# Altium schematic sheet FLATSAT001.SchDoc: Title Block Template
size A3; Engineer: M. BRINDLEY; Organization: BLUEsat Project; Address1: Room 419; Address2: School of EE&T; Address3: UNSW, NSW 2052; Address4: Australia; DocumentNumber: TITL0001; Description: Sample Title Block; Version: 1.0
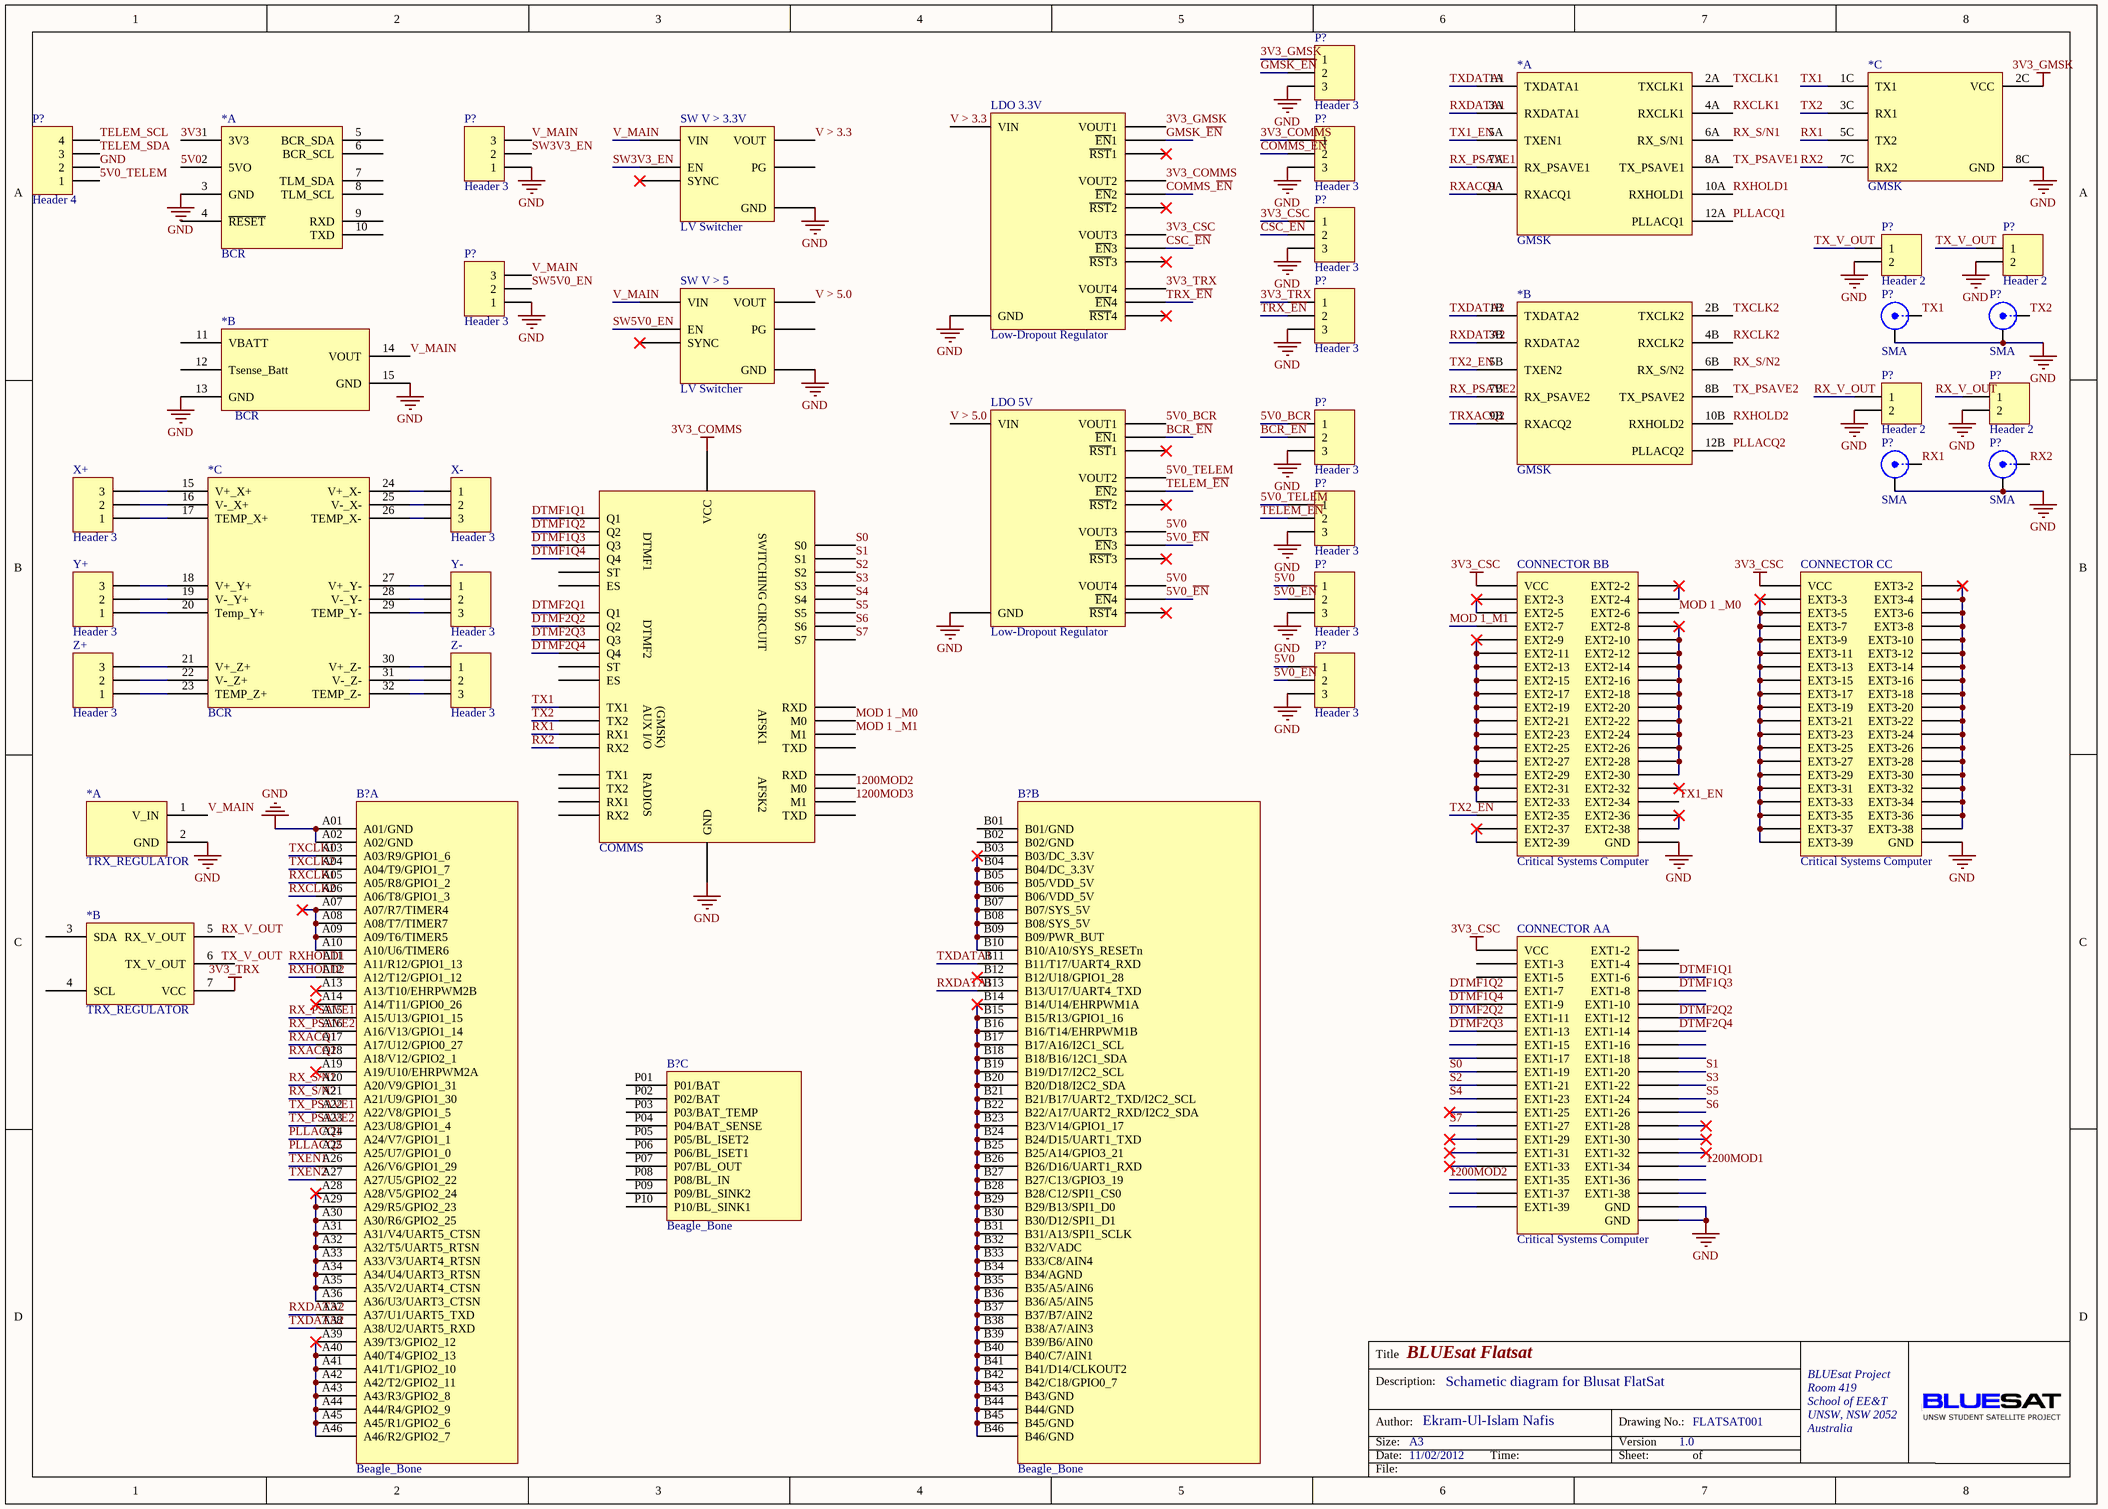
[diagram p0: FLATSAT001.SchDoc]

## Parts
(Parts that share a designator on the sheet are numbered #1, #2 ... from top to bottom, then left to right.)
*#1  GMSK  [GMSK]  (part C of 3)
*#2  GMSK  [GMSK]  (part A of 3)
*#3  BCR  (part A of 3)
*#4  BCR  (part B of 3)
*#5  GMSK  [GMSK]  (part B of 3)
*#6  BCR  (part C of 3)
*#7  TRX_REGULATOR  [TRX_REGULATOR]  (part A of 2)
*#8  TRX_REGULATOR  [TRX_REGULATOR]  (part B of 2)
B*  COMMS  [Communications]
B?#1  Beagle_Bone  [Beaglebone]  (part B of 3)
B?#2  Beagle_Bone  [Beaglebone]  (part A of 3)
B?#3  Beagle_Bone  [Beaglebone]  (part C of 3)
CONNECTOR_A  Critical Systems Computer  [CSC]  (part A of 3)
CONNECTOR_B  Critical Systems Computer  [CSC]  (part B of 3)
CONNECTOR_C  Critical Systems Computer  [CSC]  (part C of 3)
LDO_3.3V  Low-Dropout Regulator  [LDO]
LDO_5V  Low-Dropout Regulator  [LDO]
P?#1  Header 3  [HDR1X3]
P?#2  Header 3  [HDR1X3]
P?#3  Header 3  [HDR1X3]
P?#4  Header 4  [HDR1X4]
P?#5  Header 3  [HDR1X3]
P?#6  Header 2  [HDR1X2]
P?#7  Header 2  [HDR1X2]
P?#8  Header 3  [HDR1X3]
P?#9  SMA  [SMB_V-RJ45]
P?#10  SMA  [SMB_V-RJ45]
P?#11  Header 3  [HDR1X3]
P?#12  Header 2  [HDR1X2]
P?#13  Header 2  [HDR1X2]
P?#14  Header 3  [HDR1X3]
P?#15  SMA  [SMB_V-RJ45]
P?#16  SMA  [SMB_V-RJ45]
P?#17  Header 3  [HDR1X3]
P?#18  Header 3  [HDR1X3]
P?#19  Header 3  [HDR1X3]
SW_V_>_3.3V  LV Switcher  [LVSwitcher]
SW_V_>_5  LV Switcher  [LVSwitcher]
X+  Header 3  [HDR1X3]
X-  Header 3  [HDR1X3]
Y+  Header 3  [HDR1X3]
Y-  Header 3  [HDR1X3]
Z+  Header 3  [HDR1X3]
Z-  Header 3  [HDR1X3]

## Nets
3V3_COMMS: B*.?1(VCC) LDO_3.3V.VOUT2 P?#2.1
3V3_CSC: CONNECTOR_A.C1_1(VCC) CONNECTOR_B.C2_1(VCC) CONNECTOR_C.C3_1(VCC) LDO_3.3V.VOUT3 P?#5.1
3V3_GMSK: *#1.2C(VCC) LDO_3.3V.VOUT1 P?#1.1
3V3_TRX: *#8.7(VCC) LDO_3.3V.VOUT4 P?#8.1
GND: *#1.8C(GND) *#3.3(GND) *#4.13(GND) *#4.15(GND) *#7.2(GND) B*.GND B?#2.A01(A01/GND) B?#2.A02(A02/GND) CONNECTOR_A.C1_40(GND) CONNECTOR_A.GND CONNECTOR_B.C2_40(GND) CONNECTOR_C.C3_40(GND) LDO_3.3V.GND LDO_5V.GND P?#1.3 P?#2.3 P?#3.1 P?#4.2 P?#5.3 P?#6.2 P?#7.2 P?#8.3 P?#9.2(Y) P?#10.2(Y) P?#11.1 P?#12.2 P?#13.2 P?#14.3 P?#15.2(Y) P?#16.2(Y) P?#17.3 P?#18.3 P?#19.3 SW_V_>_3.3V.GND SW_V_>_5.GND
3V3: *#3.1(3V3)
5V0: *#3.2(5VO) LDO_5V.VOUT3 LDO_5V.VOUT4 P?#18.1 P?#19.1
5V0_BCR: LDO_5V.VOUT1 P?#14.1
5V0_~{EN}: LDO_5V.EN3(~{EN}3) LDO_5V.EN4(~{EN}4) P?#18.2 P?#19.2
5V0_TELEM: LDO_5V.VOUT2 P?#4.1 P?#17.1
1200MOD1: CONNECTOR_A.C1_34(EXT1-34)
1200MOD2: B*.AFSK2_M0(M0) CONNECTOR_A.C1_35(EXT1-35)
1200MOD3: B*.AFSK2_M1(M1)
BCR_~{EN}: LDO_5V.EN1(~{EN}1) P?#14.2
COMMS_~{EN}: LDO_3.3V.EN2(~{EN}2) P?#2.2
CSC_~{EN}: LDO_3.3V.EN3(~{EN}3) P?#5.2
DTMF1Q1: B*.DTMF1_Q1(Q1) CONNECTOR_A.C1_6(EXT1-6)
DTMF1Q2: B*.DTMF1_Q2(Q2) CONNECTOR_A.C1_7(EXT1-7)
DTMF1Q3: B*.DTMF1_Q3(Q3) CONNECTOR_A.C1_8(EXT1-8)
DTMF1Q4: B*.DTMF1_Q4(Q4) CONNECTOR_A.C1_9(EXT1-9)
DTMF2Q1: B*.DTMF2_Q1(Q1)
DTMF2Q2: B*.DTMF2_Q2(Q2) CONNECTOR_A.C1_11(EXT1-11) CONNECTOR_A.C1_12(EXT1-12)
DTMF2Q3: B*.DTMF2_Q3(Q3) CONNECTOR_A.C1_13(EXT1-13)
DTMF2Q4: B*.DTMF2_Q4(Q4) CONNECTOR_A.C1_14(EXT1-14)
GMSK_~{EN}: LDO_3.3V.EN1(~{EN}1) P?#1.2
MOD 1 _M0: B*.AFSK1_M0(M0) CONNECTOR_B.C2_6(EXT2-6)
MOD 1 _M1: B*.AFSK1_M1(M1)
MOD 1_M1: CONNECTOR_B.C2_7(EXT2-7)
PLLACQ1: *#2.12A(PLLACQ1) B?#2.A24(A24/V7/GPIO1_1)
PLLACQ2: *#5.12B(PLLACQ2) B?#2.A25(A25/U7/GPIO1_0)
RX1: *#1.5C(TX2) B*.GMSK_RX1(RX1) P?#15.1(X)
RX2: *#1.7C(RX2) B*.GMSK_RX2(RX2) P?#16.1(X)
RX_PSAVE1: *#2.7A(RX_PSAVE1) B?#2.A15(A15/U13/GPIO1_15)
RX_PSAVE2: *#5.7B(RX_PSAVE2) B?#2.A16(A16/V13/GPIO1_14)
RX_S/N1: *#2.6A(RX_S/N1) B?#2.A20(A20/V9/GPIO1_31)
RX_S/N2: *#5.6B(RX_S/N2) B?#2.A21(A21/U9/GPIO1_30)
RX_V_OUT: P?#12.1 P?#13.1
RXACQ1: *#2.9A(RXACQ1) B?#2.A17(A17/U12/GPIO0_27)
RXACQ2: B?#2.A18(A18/V12/GPIO2_1)
RXCLK1: *#2.4A(RXCLK1) B?#2.A05(A05/R8/GPIO1_2)
RXCLK2: *#5.4B(RXCLK2) B?#2.A06(A06/T8/GPIO1_3)
RXDATA1: *#2.3A(RXDATA1) B?#1.B13(B13/U17/UART4_TXD)
RXDATA2: *#5.3B(RXDATA2) B?#2.A37(A37/U1/UART5_TXD)
RXHOLD1: *#2.10A(RXHOLD1) B?#2.A11(A11/R12/GPIO1_13)
RXHOLD2: *#5.10B(RXHOLD2) B?#2.A12(A12/T12/GPIO1_12)
S0: B*.S0 CONNECTOR_A.C1_19(EXT1-19)
S1: B*.S1 CONNECTOR_A.C1_20(EXT1-20)
S2: B*.S2 CONNECTOR_A.C1_21(EXT1-21)
S3: B*.S3 CONNECTOR_A.C1_22(EXT1-22)
S4: B*.S4 CONNECTOR_A.C1_23(EXT1-23)
S5: B*.S5 CONNECTOR_A.C1_24(EXT1-24)
S6: B*.S6 CONNECTOR_A.C1_26(EXT1-26)
S7: B*.S7 CONNECTOR_A.C1_27(EXT1-27)
SW3V3_EN: P?#3.2 SW_V_>_3.3V.EN
SW5V0_EN: P?#11.2 SW_V_>_5.EN
TELEM_~{EN}: LDO_5V.EN2(~{EN}2) P?#17.2
TELEM_SCL: P?#4.4
TELEM_SDA: P?#4.3
TRX_~{EN}: LDO_3.3V.EN4(~{EN}4) P?#8.2
TRXACQ2: *#5.9B(RXACQ2)
TX1: *#1.1C(TX1) B*.GMSK_TX1(TX1) P?#9.1(X)
TX1_EN: *#2.5A(TXEN1) CONNECTOR_B.C2_34(EXT2-34)
TX2: *#1.3C(RX1) B*.GMSK_TX2(TX2) P?#10.1(X)
TX2_EN: *#5.5B(TXEN2) CONNECTOR_B.C2_35(EXT2-35)
TX_PSAVE1: *#2.8A(TX_PSAVE1) B?#2.A22(A22/V8/GPIO1_5)
TX_PSAVE2: *#5.8B(TX_PSAVE2) B?#2.A23(A23/U8/GPIO1_4)
TX_V_OUT: P?#6.1 P?#7.1
TXCLK1: *#2.2A(TXCLK1) B?#2.A03(A03/R9/GPIO1_6)
TXCLK2: *#5.2B(TXCLK2) B?#2.A04(A04/T9/GPIO1_7)
TXDATA1: *#2.1A(TXDATA1) B?#1.B11(B11/T17/UART4_RXD)
TXDATA2: *#5.1B(TXDATA2) B?#2.A38(A38/U2/UART5_RXD)
TXEN1: B?#2.A26(A26/V6/GPIO1_29)
TXEN2: B?#2.A27(A27/U5/GPIO2_22)
V > 3.3: LDO_3.3V.VIN SW_V_>_3.3V.Vout(VOUT)
V > 5.0: LDO_5V.VIN SW_V_>_5.Vout(VOUT)
V_MAIN: *#4.14(VOUT) *#7.1(V_IN) P?#3.3 P?#11.3 SW_V_>_3.3V.Vin(VIN) SW_V_>_5.Vin(VIN)
Net*#6_15: *#6.15(V+_X+) X+.3
Net*#6_16: *#6.16(V-_X+) X+.2
Net*#6_17: *#6.17(TEMP_X+) X+.1
Net*#6_18: *#6.18(V+_Y+) Y+.3
Net*#6_19: *#6.19(V-_Y+) Y+.2
Net*#6_20: *#6.20(Temp_Y+) Y+.1
Net*#6_21: *#6.21(V+_Z+) Z+.3
Net*#6_22: *#6.22(V-_Z+) Z+.2
Net*#6_23: *#6.23(TEMP_Z+) Z+.1
Net*#6_24: *#6.24(V+_X-) X-.1
Net*#6_25: *#6.25(V-_X-) X-.2
Net*#6_26: *#6.26(TEMP_X-) X-.3
Net*#6_27: *#6.27(V+_Y-) Y-.1
Net*#6_28: *#6.28(V-_Y-) Y-.2
Net*#6_29: *#6.29(TEMP_Y-) Y-.3
Net*#6_30: *#6.30(V+_Z-) Z-.1
Net*#6_31: *#6.31(V-_Z-) Z-.2
Net*#6_32: *#6.32(TEMP_Z-) Z-.3
NetB?#1_B03: B?#1.B03(B03/DC_3.3V) B?#1.B04(B04/DC_3.3V) B?#1.B05(B05/VDD_5V) B?#1.B06(B06/VDD_5V) B?#1.B07(B07/SYS_5V) B?#1.B08(B08/SYS_5V) B?#1.B09(B09/PWR_BUT) B?#1.B10(B10/A10/SYS_RESETn)
NetB?#1_B14: B?#1.B14(B14/U14/EHRPWM1A) B?#1.B15(B15/R13/GPIO1_16) B?#1.B16(B16/T14/EHRPWM1B) B?#1.B17(B17/A16/I2C1_SCL) B?#1.B18(B18/B16/12C1_SDA) B?#1.B19(B19/D17/I2C2_SCL) B?#1.B20(B20/D18/I2C2_SDA) B?#1.B21(B21/B17/UART2_TXD/I2C2_SCL) B?#1.B22(B22/A17/UART2_RXD/I2C2_SDA) B?#1.B23(B23/V14/GPIO1_17) B?#1.B24(B24/D15/UART1_TXD) B?#1.B25(B25/A14/GPIO3_21) B?#1.B26(B26/D16/UART1_RXD) B?#1.B27(B27/C13/GPIO3_19) B?#1.B28(B28/C12/SPI1_CS0) B?#1.B29(B29/B13/SPI1_D0) B?#1.B30(B30/D12/SPI1_D1) B?#1.B31(B31/A13/SPI1_SCLK) B?#1.B32(B32/VADC) B?#1.B33(B33/C8/AIN4) B?#1.B34(B34/AGND) B?#1.B35(B35/A5/AIN6) B?#1.B36(B36/A5/AIN5) B?#1.B37(B37/B7/AIN2) B?#1.B38(B38/A7/AIN3) B?#1.B39(B39/B6/AIN0) B?#1.B40(B40/C7/AIN1) B?#1.B41(B41/D14/CLKOUT2) B?#1.B42(B42/C18/GPIO0_7) B?#1.B43(B43/GND) B?#1.B44(B44/GND) B?#1.B45(B45/GND) B?#1.B46(B46/GND)
NetB?#2_A07: B?#2.A07(A07/R7/TIMER4) B?#2.A08(A08/T7/TIMER7) B?#2.A09(A09/T6/TIMER5) B?#2.A10(A10/U6/TIMER6)
NetB?#2_A28: B?#2.A28(A28/V5/GPIO2_24) B?#2.A29(A29/R5/GPIO2_23) B?#2.A30(A30/R6/GPIO2_25) B?#2.A31(A31/V4/UART5_CTSN) B?#2.A32(A32/T5/UART5_RTSN) B?#2.A33(A33/V3/UART4_RTSN) B?#2.A34(A34/U4/UART3_RTSN) B?#2.A35(A35/V2/UART4_CTSN) B?#2.A36(A36/U3/UART3_CTSN)
NetB?#2_A39: B?#2.A39(A39/T3/GPIO2_12) B?#2.A40(A40/T4/GPIO2_13) B?#2.A41(A41/T1/GPIO2_10) B?#2.A42(A42/T2/GPIO2_11) B?#2.A43(A43/R3/GPIO2_8) B?#2.A44(A44/R4/GPIO2_9) B?#2.A45(A45/R1/GPIO2_6) B?#2.A46(A46/R2/GPIO2_7)
NetCONNECTOR_B_C2_2: CONNECTOR_B.C2_2(EXT2-2) CONNECTOR_B.C2_4(EXT2-4)
NetCONNECTOR_B_C2_3: CONNECTOR_B.C2_3(EXT2-3) CONNECTOR_B.C2_5(EXT2-5)
NetCONNECTOR_B_C2_8: CONNECTOR_B.C2_8(EXT2-8) CONNECTOR_B.C2_10(EXT2-10) CONNECTOR_B.C2_12(EXT2-12) CONNECTOR_B.C2_14(EXT2-14) CONNECTOR_B.C2_16(EXT2-16) CONNECTOR_B.C2_18(EXT2-18) CONNECTOR_B.C2_20(EXT2-20) CONNECTOR_B.C2_22(EXT2-22) CONNECTOR_B.C2_24(EXT2-24) CONNECTOR_B.C2_26(EXT2-26) CONNECTOR_B.C2_28(EXT2-28) CONNECTOR_B.C2_30(EXT2-30)
NetCONNECTOR_B_C2_9: CONNECTOR_B.C2_9(EXT2-9) CONNECTOR_B.C2_11(EXT2-11) CONNECTOR_B.C2_13(EXT2-13) CONNECTOR_B.C2_15(EXT2-15) CONNECTOR_B.C2_17(EXT2-17) CONNECTOR_B.C2_19(EXT2-19) CONNECTOR_B.C2_21(EXT2-21) CONNECTOR_B.C2_23(EXT2-23) CONNECTOR_B.C2_25(EXT2-25) CONNECTOR_B.C2_27(EXT2-27) CONNECTOR_B.C2_29(EXT2-29) CONNECTOR_B.C2_31(EXT2-31) CONNECTOR_B.C2_33(EXT2-33)
NetCONNECTOR_B_C2_36: CONNECTOR_B.C2_36(EXT2-36) CONNECTOR_B.C2_38(EXT2-38)
NetCONNECTOR_B_C2_37: CONNECTOR_B.C2_37(EXT2-37) CONNECTOR_B.C2_39(EXT2-39)
NetCONNECTOR_C_C3_2: CONNECTOR_C.C3_2(EXT3-2) CONNECTOR_C.C3_4(EXT3-4) CONNECTOR_C.C3_6(EXT3-6) CONNECTOR_C.C3_8(EXT3-8) CONNECTOR_C.C3_10(EXT3-10) CONNECTOR_C.C3_12(EXT3-12) CONNECTOR_C.C3_14(EXT3-14) CONNECTOR_C.C3_16(EXT3-16) CONNECTOR_C.C3_18(EXT3-18) CONNECTOR_C.C3_20(EXT3-20) CONNECTOR_C.C3_22(EXT3-22) CONNECTOR_C.C3_24(EXT3-24) CONNECTOR_C.C3_26(EXT3-26) CONNECTOR_C.C3_28(EXT3-28) CONNECTOR_C.C3_30(EXT3-30) CONNECTOR_C.C3_32(EXT3-32) CONNECTOR_C.C3_34(EXT3-34) CONNECTOR_C.C3_36(EXT3-36) CONNECTOR_C.C3_38(EXT3-38)
NetCONNECTOR_C_C3_3: CONNECTOR_C.C3_3(EXT3-3) CONNECTOR_C.C3_5(EXT3-5) CONNECTOR_C.C3_7(EXT3-7) CONNECTOR_C.C3_9(EXT3-9) CONNECTOR_C.C3_11(EXT3-11) CONNECTOR_C.C3_13(EXT3-13) CONNECTOR_C.C3_15(EXT3-15) CONNECTOR_C.C3_17(EXT3-17) CONNECTOR_C.C3_19(EXT3-19) CONNECTOR_C.C3_21(EXT3-21) CONNECTOR_C.C3_23(EXT3-23) CONNECTOR_C.C3_25(EXT3-25) CONNECTOR_C.C3_27(EXT3-27) CONNECTOR_C.C3_29(EXT3-29) CONNECTOR_C.C3_31(EXT3-31) CONNECTOR_C.C3_33(EXT3-33) CONNECTOR_C.C3_35(EXT3-35) CONNECTOR_C.C3_37(EXT3-37) CONNECTOR_C.C3_39(EXT3-39)

Not connected (* = marked no-connect by the designer): *#3 4(~{RESET}) 5(BCR_SDA) 6(BCR_SCL) 7(TLM_SDA) 8(TLM_SCL) 9(RXD) 10(TXD); *#4 11(VBATT) 12(Tsense_Batt); *#8 3(SDA) 4(SCL) 5(RX_V_OUT) 6(TX_V_OUT); B* AFSK1_RXD(RXD) AFSK1_TXD(TXD) AFSK2_RXD(RXD) AFSK2_TXD(TXD) DTMF1_ES(ES) DTMF1_ST(ST) DTMF2_ES(ES) DTMF2_ST(ST) RX2(RX1) TX1 TX2; B?#1 B01(B01/GND) B02(B02/GND) B12(B12/U18/GPIO1_28)*; B?#2 A13(A13/T10/EHRPWM2B)* A14(A14/T11/GPIO0_26)* A19(A19/U10/EHRPWM2A)*; B?#3 P01(P01/BAT) P02(P02/BAT) P03(P03/BAT_TEMP) P04(P04/BAT_SENSE) P05(P05/BL_ISET2) P06(P06/BL_ISET1) P07(P07/BL_OUT) P08(P08/BL_IN) P09(P09/BL_SINK2) P10(P10/BL_SINK1); CONNECTOR_A C1_2(EXT1-2) C1_3(EXT1-3) C1_4(EXT1-4) C1_5(EXT1-5) C1_10(EXT1-10) C1_15(EXT1-15) C1_16(EXT1-16) C1_17(EXT1-17) C1_18(EXT1-18) C1_25(EXT1-25)* C1_28(EXT1-28)* C1_29(EXT1-29)* C1_30(EXT1-30)* C1_31(EXT1-31)* C1_32(EXT1-32)* C1_33(EXT1-33)* C1_36(EXT1-36) C1_37(EXT1-37) C1_38(EXT1-38) C1_39(EXT1-39); CONNECTOR_B C2_32(EXT2-32)*; LDO_3.3V RST1(~{RST}1)* RST2(~{RST}2)* RST3(~{RST}3)* RST4(~{RST}4)*; LDO_5V RST1(~{RST}1)* RST2(~{RST}2)* RST3(~{RST}3)* RST4(~{RST}4)*; SW_V_>_3.3V PG SYNC*; SW_V_>_5 PG SYNC*

## Notes on the sheet
- Title
- Description:
- BLUEsat Flatsat
- Schametic diagram for Blusat FlatSat
- Size:
- Author:
- Date:
- 11/02/2012
- A3
- Ekram-Ul-Islam Nafis
- Time:
- Version
- Sheet:
- Drawing No.:
- FLATSAT001
- of
- File:
- Labels drawn without touching a wire or pin: RX_V_OUT, TX_V_OUT
- (in symbol COMMS) DTMF1; SWITCHING CIRCUIT; DTMF2; AUX I/O; (GMSK); AFSK1; RADIOS; AFSK2

## Library data of the parts
CONNECTOR_A CONNECTOR_B CONNECTOR_C = CSC
LDO_3.3V LDO_5V = LDO
P?#1-P?#3 P?#5 P?#8 P?#11 P?#14 P?#17-P?#19 X+ X- Y+ Y- Z+ Z- = Header 3: Header, 3-Pin; LatestRevisionDate: 17-Jul-2002; LatestRevisionNote: Re-released for DXP Platform.; Publisher: Altium Limited
P?#4 = Header 4: Header, 4-Pin; LatestRevisionDate: 17-Jul-2002; LatestRevisionNote: Re-released for DXP Platform.; Publisher: Altium Limited
P?#6 P?#7 P?#12 P?#13 = Header 2: Header, 2-Pin; LatestRevisionDate: 17-Jul-2002; LatestRevisionNote: Re-released for DXP Platform.; Publisher: Altium Limited
P?#9 P?#10 P?#15 P?#16 = SMB: SMB Straight Connector; LatestRevisionDate: 17-Jul-2002; LatestRevisionNote: Re-released for DXP Platform.; Publisher: Altium Limited
SW_V_>_3.3V SW_V_>_5 = LVSWITCHER